# Altium project ESD-MONITOR.PrjPcb
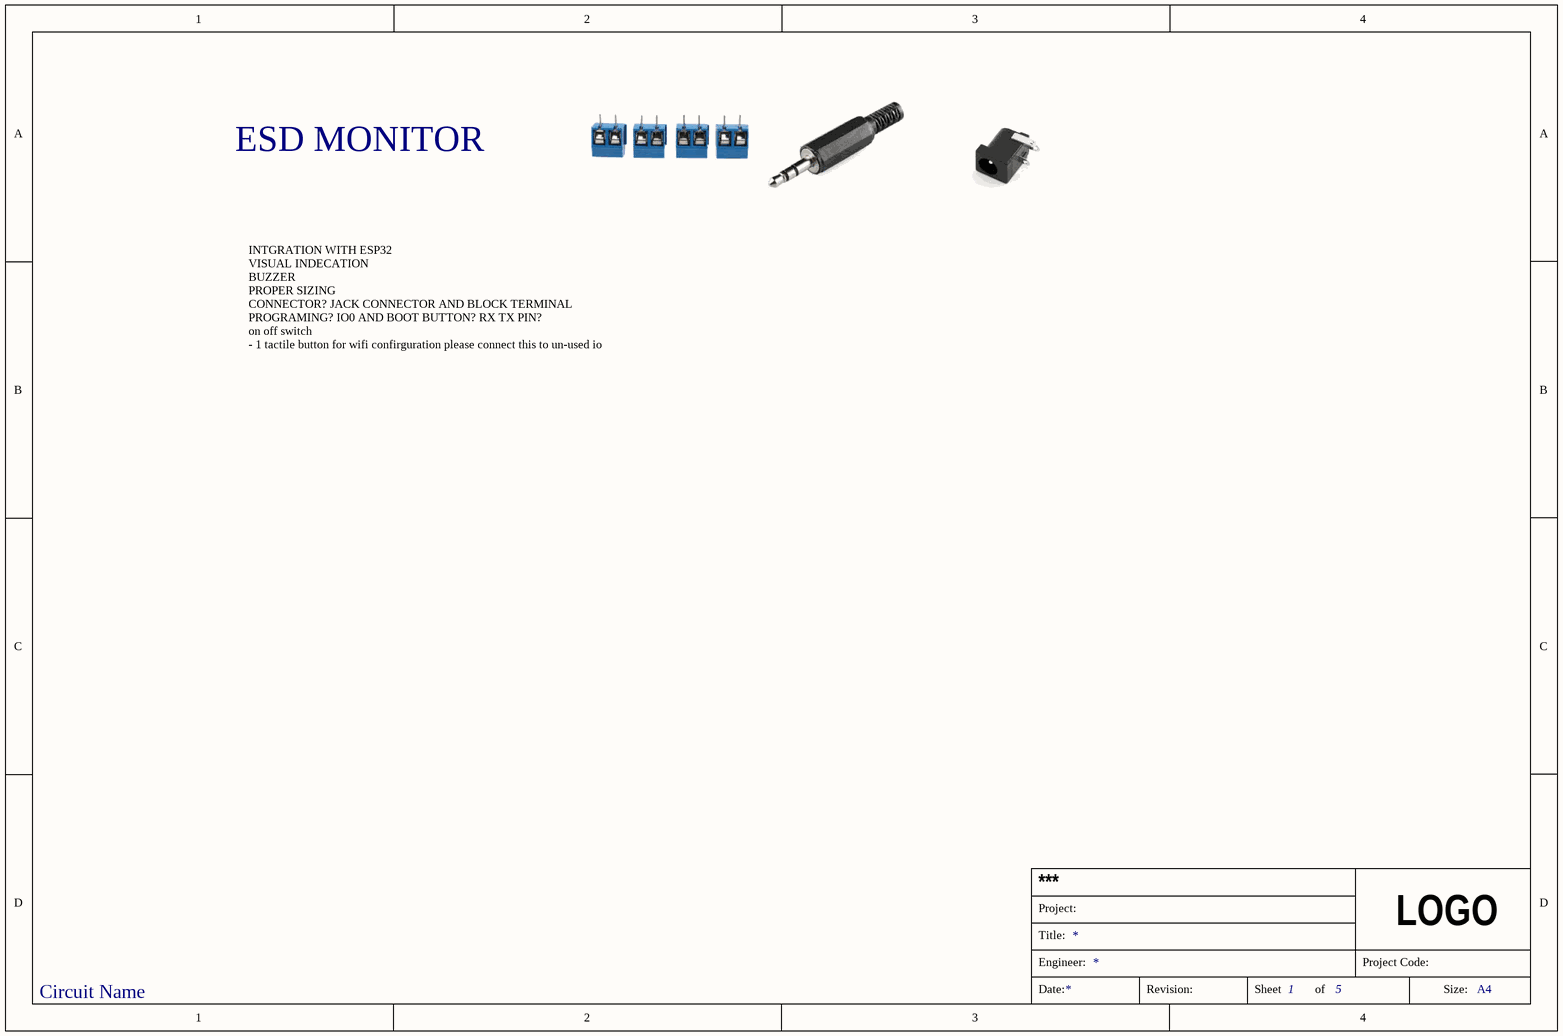
[diagram p0: ESD-INTERFACE.SchDoc]
6 sheets, 65 parts. Net scope: flat (ports and power ports of the same name join across sheets).
Board file: ESD-MAIN_PCB.PcbDoc
Sheets:
  ESD-INTERFACE.SchDoc
  ESD-HISTORY.SchDoc
  ESD-ESP32.SchDoc
  Sheet2.SchDoc
  ESD-MATT.SchDoc
  ESD-OP.SchDoc

## Sheet ESD-INTERFACE.SchDoc
size A4; DocumentNumber: 2; SheetNumber: 1; SheetTotal: 5

### Notes on the sheet
- ESD MONITOR
- INTGRATION WITH ESP32
  VISUAL INDECATION
  BUZZER
  PROPER SIZING
  CONNECTOR? JACK CONNECTOR AND BLOCK TERMINAL
  PROGRAMING? IO0 AND BOOT BUTTON? RX TX PIN?
  on off switch
  - 1 tactile button for wifi confirguration please connect this to un-used io
- Circuit Name
- Project:
- ***
- Title:
- Engineer:
- Project Code:
- LOGO
- Date:
- Revision:
- Sheet
- of
- Size:
- A4

## Sheet ESD-HISTORY.SchDoc
size A4; DocumentNumber: 1; SheetNumber: 2; SheetTotal: 6
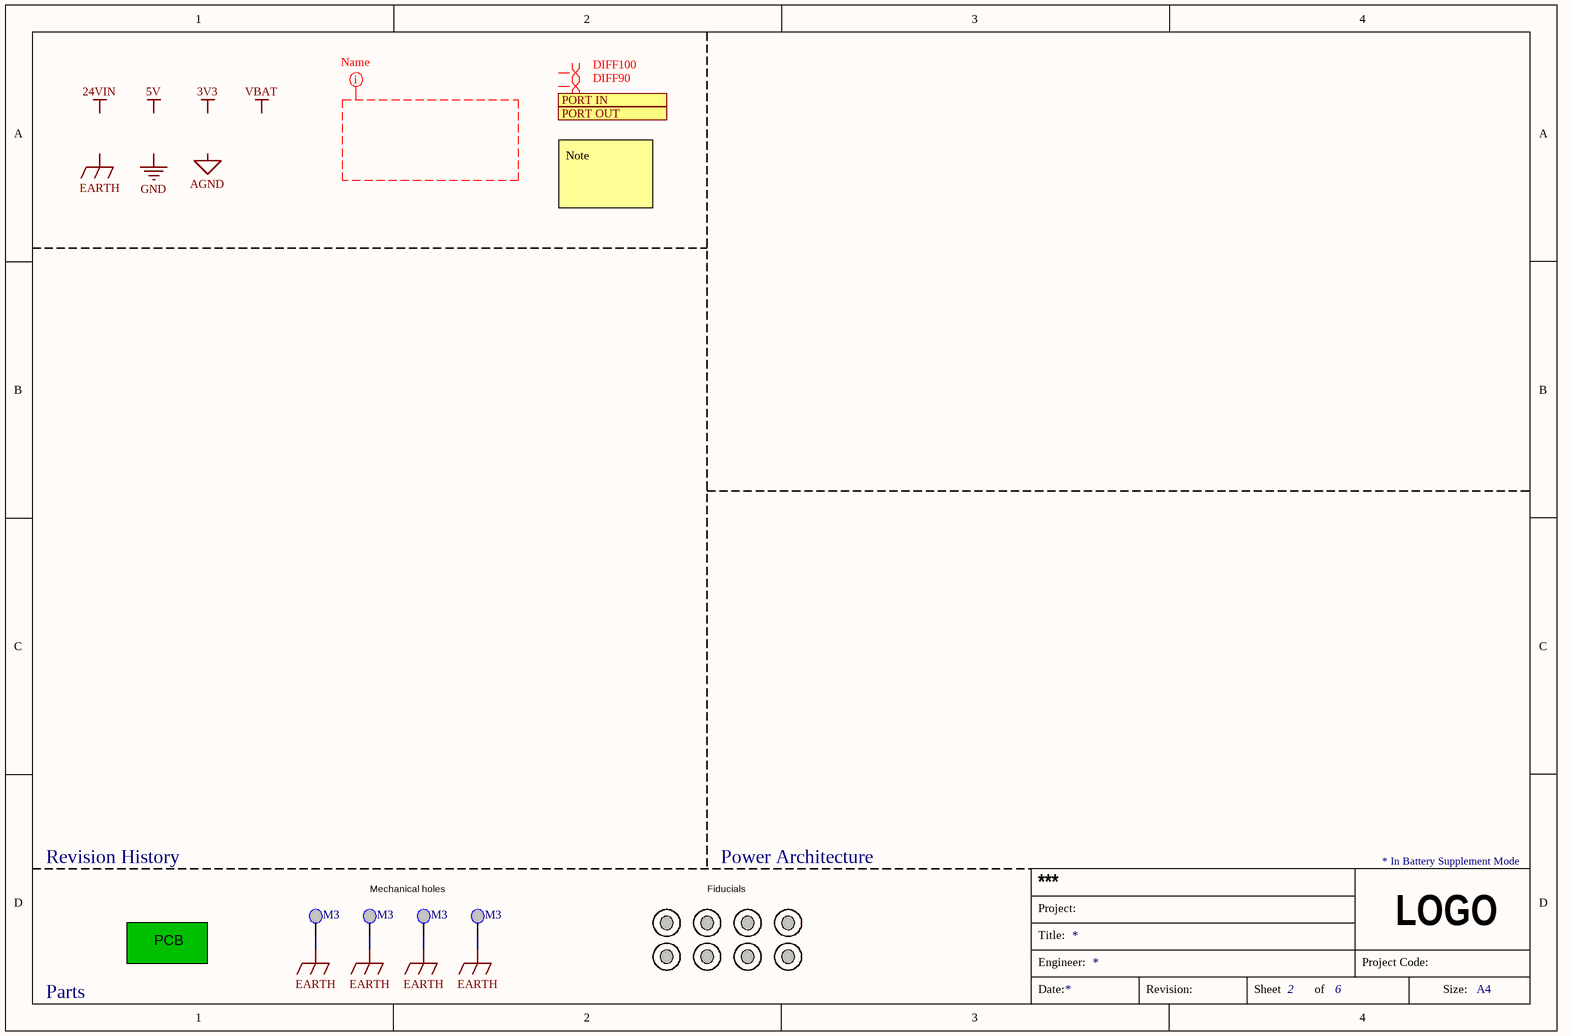
[diagram p1: ESD-HISTORY.SchDoc]

### Parts
_PCB1  PCB spec  (value not drawn)  (mechanical)
FD1  Fiducial 1.3  [Fiducial 1.3mm]  (value not drawn)  (no BOM)
FD2  Fiducial 1.3  [Fiducial 1.3mm]  (value not drawn)  (no BOM)
FD3  Fiducial 1.3  [Fiducial 1.3mm]  (value not drawn)  (no BOM)
FD4  Fiducial 1.3  [Fiducial 1.3mm]  (value not drawn)  (no BOM)
FD5  Fiducial 1.3  [Fiducial 1.3mm]  (value not drawn)  (no BOM)
FD6  Fiducial 1.3  [Fiducial 1.3mm]  (value not drawn)  (no BOM)
FD7  Fiducial 1.3  [Fiducial 1.3mm]  (value not drawn)  (no BOM)
FD8  Fiducial 1.3  [Fiducial 1.3mm]  (value not drawn)  (no BOM)
MEC1  M3  [M3 hole]  (no BOM)
MEC2  M3  [M3 hole]  (no BOM)
MEC3  M3  [M3 hole]  (no BOM)
MEC4  M3  [M3 hole]  (no BOM)

### Ports
PORT IN (in), PORT OUT (out)

### Nets
EARTH: MEC1.0 MEC2.0 MEC3.0 MEC4.0

### Layout directives
net class NetClass: (no net found under the mark)
differential pair; net class DIFF100: (no net found under the mark)
differential pair; net class DIFF90: (no net found under the mark)

### Notes on the sheet
- Note
- Revision History
- Mechanical holes
- Fiducials
- Power Architecture
- * In Battery Supplement Mode
- Parts
- Labels drawn without touching a wire or pin: 3V3, 5V, 24VIN, AGND, EARTH, GND, VBAT
- Project:
- ***
- Title:
- Engineer:
- Project Code:
- LOGO
- Date:
- Revision:
- Sheet
- of
- Size:
- A4

### Library data of the parts
_PCB1 = PCB
FD1-FD8 = Fiducial 1.3: Fiducial 1.3mm
MEC1-MEC4 = M3 hole

## Sheet ESD-ESP32.SchDoc
size A; SheetNumber: 3; SheetTotal: 6
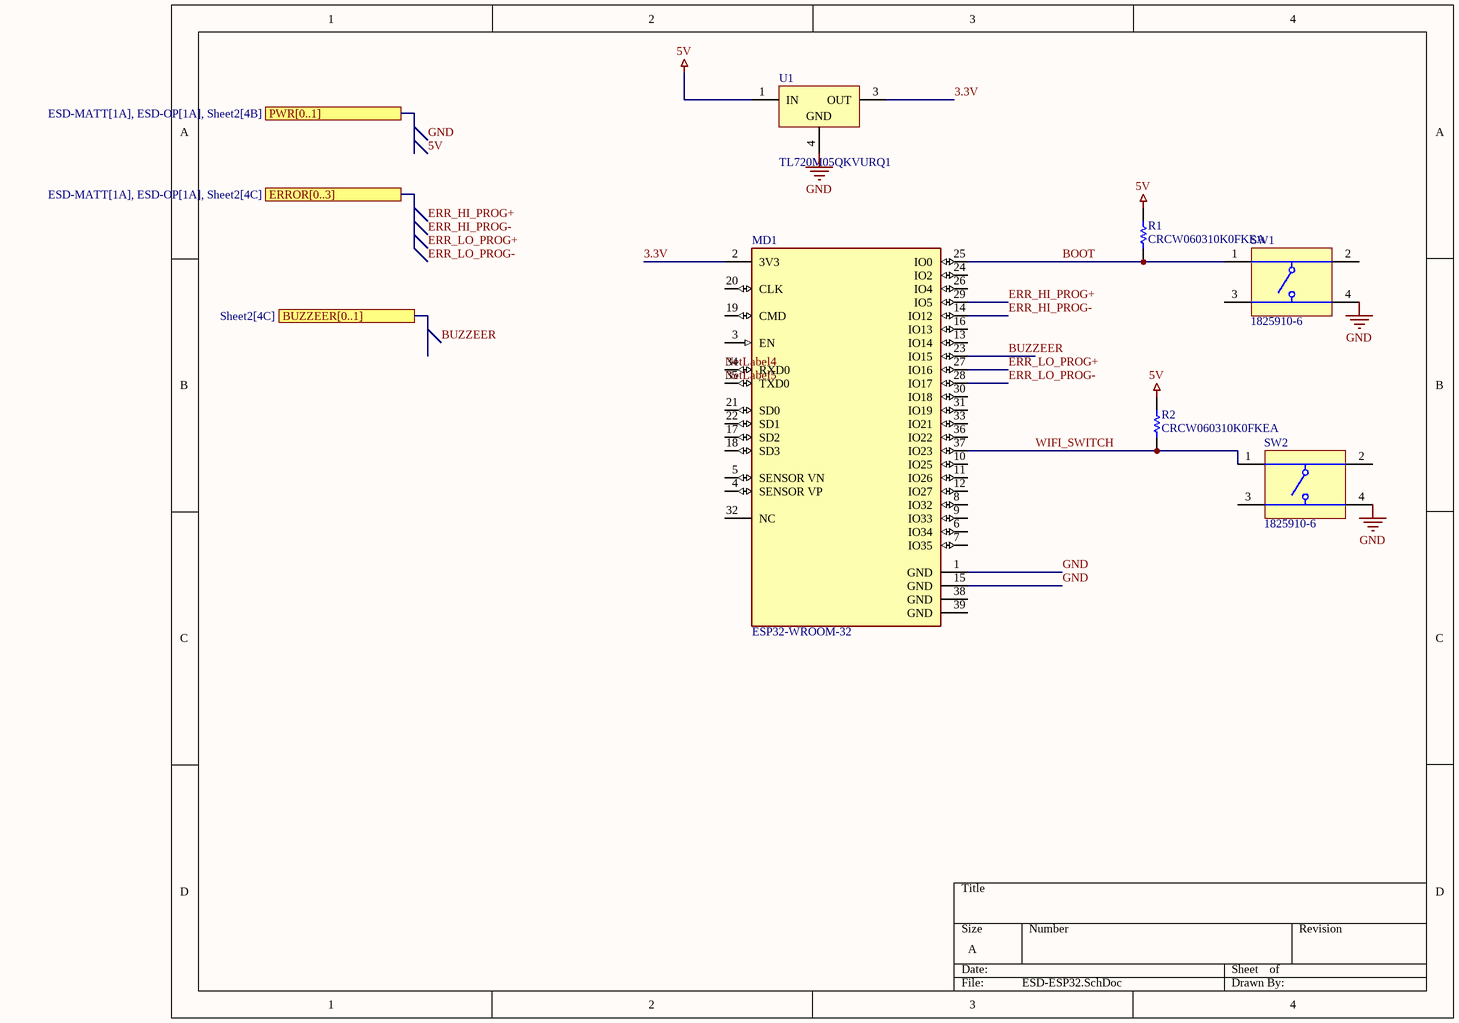
[diagram p2: ESD-ESP32.SchDoc]

### Parts
MD1  ESP32-WROOM-32  [FP-ESP32-WROOM-32-MFG]
R1  CRCW060310K0FKEA  [RESC1609X50X30NL8T20]
R2  CRCW060310K0FKEA  [RESC1609X50X30NL8T20]
SW1  1825910-6  [TECO-1825910-6_V]
SW2  1825910-6  [TECO-1825910-6_V]
U1  TL720M05QKVURQ1  [KVU0003A_M]

### Ports
BUZZEER[0..1] (see Sheet2[4C]), ERROR[0..3] (see ESD-MATT[1A], ESD-OP[1A], Sheet2[4C]), PWR[0..1] (see ESD-MATT[1A], ESD-OP[1A], Sheet2[4B])

### Nets
5V: R1.2 R2.2 U1.1(IN)  [project net ERR_HI_PROG+]
GND: MD1.1(GND) MD1.15(GND) SW1.4 SW2.4 U1.4(GND)  [project net ERR_LO_PROG-]
3.3V: MD1.2(3V3) U1.3(OUT)
BOOT: MD1.25(IO0) R1.1 SW1.1
BUZZEER: MD1.23(IO15)
ERR_HI_PROG+: MD1.29(IO5)
ERR_HI_PROG-: MD1.14(IO12)
ERR_LO_PROG+: MD1.27(IO16)
ERR_LO_PROG-: MD1.28(IO17)
NetLabel4: MD1.34(RXD0)
NetLabel5: MD1.35(TXD0)
WIFI_SWITCH: MD1.37(IO23) R2.1 SW2.1

Not connected (* = marked no-connect by the designer): MD1 3(EN) 4(SENSOR_VP) 5(SENSOR_VN) 6(IO34) 7(IO35) 8(IO32) 9(IO33) 10(IO25) 11(IO26) 12(IO27) 13(IO14) 16(IO13) 17(SD2) 18(SD3) 19(CMD) 20(CLK) 21(SD0) 22(SD1) 24(IO2) 26(IO4) 30(IO18) 31(IO19) 32(NC) 33(IO21) 36(IO22) 38(GND) 39(GND); SW1 2 3; SW2 2 3

### Notes on the sheet
- Labels drawn without touching a wire or pin: 5V, BUZZEER, ERR_HI_PROG+, ERR_HI_PROG-, ERR_LO_PROG+, ERR_LO_PROG-, GND

### Library data of the parts
MD1 = CMP-194065-000008-1: RX TXRX MOD WIFI SURFACE MOUNT; Frequency: 2.5GHz; Sensitivity: -98dBm; Operating Supply Voltage: 3.6V; Data Rate: 150Mbps; Weight: 0.088185oz; Package Quantity: 550; Min Operating Temperature: -40°C; Mount: Surface Mount; Max Operating Temperature: 85°C; Packaging: Cut Tape; Case/Package: SMD/SMT
R1 R2 = CMP-1666-00005-4: Chip Resistor, 10 KOhm, +/- 1%, 100 mW, -55 to 155 degC, 0603 (1608 Metric), RoHS, Tape and Reel; Manufacturer: Vishay Semiconductor; Voltage Rating: 75 V; Max Operating Temperature: 155 degC; PackageDescription: 2-Pin Surface Mount Device, Body 1.575 x 0.85 mm; ComponentLink1Description: Manufacturer URL; RoHSCompliant: true; PackageReference: 0603; REACH SVHC: Unknown; Length: 1.55 mm; DatasheetVersion: 06/2012; Packaging: Tape and Reel; Min Operating Temperature: -55 degC; Mounting Technology: Surface Mount; ComponentLink2URL: https://datasheet.ciiva.com/11809/0900766b80d98afc-11809037.pdf; Height: 0.45 mm; ComponentLink2Description: Datasheet; Package Quantity: 5000; ComponentLink1URL: http://www.vishay.com/
SW1 SW2 = CMP-1684-00021-1: Tact Switch, SPST-NO, 0.05 A, -35 to 85 degC, 4-Pin THD, RoHS, Bulk; Manufacturer: TE Connectivity; Maximum Contact Resistance: 100mOhm; Mechanical Life: 100000Cycles; Bushing Type: Unthreaded; Switch Configuration: OFF(ON); Maximum DC Voltage Rating: 24V; Contact Rating @ Voltage: 0.05A@24VDC; Actuator Color: Black; Body Orientation: Straight; Function: MomentaryContact; Illumination: N/R; Actuator Style: RoundButton; Actuator Material: PolybutyleneTerephthalate; Dielectric Strength: 500VAC; Pole Throw Configuration: SPST; Actuator Length: 1.4mm; Product Weight: N/A; Contact Material: CopperAlloy; Housing Material: N/A; Terminal Type: PCPins; Minimum Insulation Resistance: 100MOhm; Package Description: 4-Pin Through Hole Device, Body 5.99 x 5.99 mm, Pitch 6.5 mm; Part No: 1825910-6; Package Reference: THD; Base Material: N/A; Manufacturer URL: http://www.te.com; Contact Plating: Silver; RoHS: Yes; Datasheet Version: Rev. C9; Electrical Life: 100000Cycles; Maximum AC Voltage Rating: N/A; Thread Size: N/R; Operating Temperature: -35to85C; Mounting: ThroughHole; Dimension: 5.99x5mm; Datasheet URL: http://www.te.com/commerce/DocumentDelivery/DDEController?Action=showdoc&DocId=Customer+Drawing%7F1825910%7FC9%7Fpdf%7FEnglish%7FENG_CD_1825910_C9.pdf%7F1825910-6; Family: 1825910; Seal Location: N/A; Seal Description: N/A; Packaging: N/A
U1 = CMP-0395-01074-2: Single Output Automotive LDO, 700 mA, Fixed 5 V Output, 5.5 to 42 V Input, 3-pin PFM (KVU), -40 to 125 degC, Green (RoHS & no Sb/Br); Manufacturer: Texas Instruments; Vin(Max)(V): 42; Vout Adj(Min)(V): 5; Vin(Min)(V): 5.5; Iq(Typ)(mA): 12; SubFamily: Single Channel LDO; Accuracy(%): 3; Vdo(Typ)(mV): 250; Iout(Max)(A): 0.7; Mounting Technology: Surface Mount; ComponentLink1Description: Manufacturer URL; Code_JEDEC: TO-252; ComponentLink3URL: http://www.ti.com/litv/pdf/mpsf018c; Fixed Output Options(V): 5; ComponentLink2URL: http://www.ti.com/general/docs/lit/getliterature.tsp?genericPartNumber=TL720M05-Q1&fileType=pdf; ComponentLink2Description: Datasheet; ComponentLink3Description: Package Specification; PackageReference: KVU0003A; PackageVersion: 4205521-2/D; PartNumber: TL720M05QKVURQ1; PackageDescription: 3-Pin Plastic Flange Mount, Body 6.1 x 6.6 mm, Pitch 2.29 mm; DatasheetVersion: SGLS380D; Eco-Plan: Green (RoHS & no Sb/Br); ComponentLink1URL: http://www.ti.com/; Vout Adj(Max)(V): 5

## Sheet Sheet2.SchDoc
size A; SheetNumber: 4; SheetTotal: 6
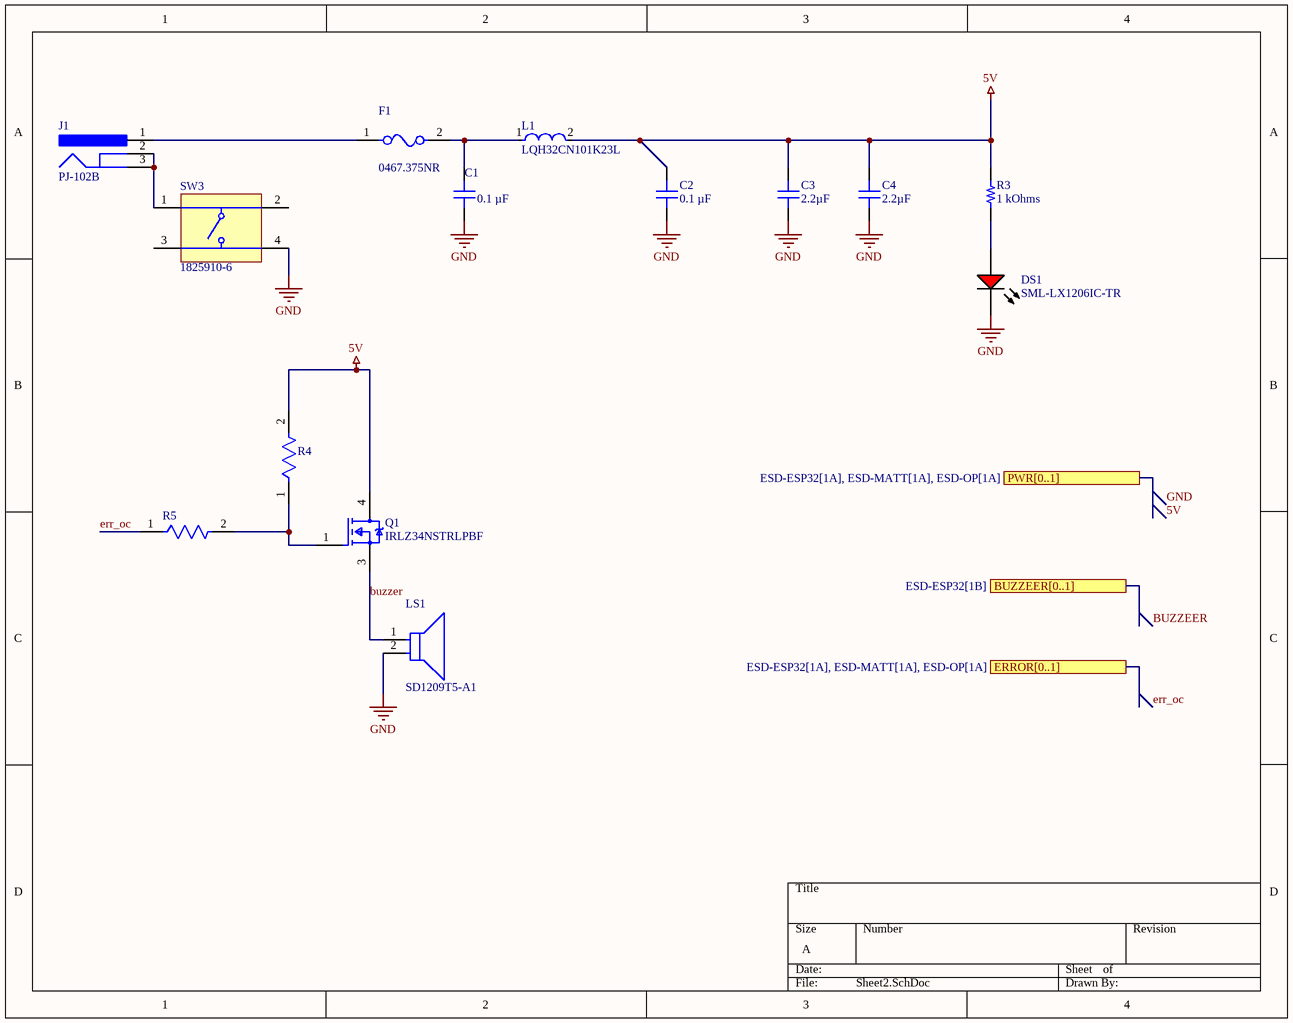
[diagram p3: Sheet2.SchDoc]

### Parts
C1  0.1 µF  [CAP 0603_1608]
C2  0.1 µF  [CAP 0603_1608]
C3  2.2µF  [CAP 0603_1608]
C4  2.2µF  [CAP 0603_1608]
DS1  SML-LX1206IC-TR  [LUMX-SML-LX1206IC_V]
F1  0467.375NR  [FP-467-MFG]
J1  PJ-102B  [CUI-PJ-102B_V]
L1  LQH32CN101K23L  [FP-LQH32CH_23-MFG]
LS1  SD1209T5-A1  [FP-SD1209-MFG]
Q1  IRLZ34NSTRLPBF  [FP-PG-TO263-3-MFG]
R3  1 kOhms  [KOA RES RK73 RN73 0402_1005]
R4  AC0603FR-072KL  [FP-AC0603-IPC_B]  (value not drawn)
R5  AC0603FR-072KL  [FP-AC0603-IPC_B]  (value not drawn)
SW3  1825910-6  [TECO-1825910-6_V]

### Ports
BUZZEER[0..1] (see ESD-ESP32[1B]), ERROR[0..1] (see ESD-ESP32[1A], ESD-MATT[1A], ESD-OP[1A]), PWR[0..1] (see ESD-ESP32[1A], ESD-MATT[1A], ESD-OP[1A])

### Nets
5V: C2.2 C3.2 C4.2 L1.2 Q1.4(D) R3.2 R4.2  [project net ERR_HI_PROG+]
GND: C1.1 C2.1 C3.1 C4.1 DS1.2(K) LS1.2(A) SW3.4  [project net ERR_LO_PROG-]
buzzer: LS1.1(C) Q1.3(S)
err_oc: R5.1
NetC1_2: C1.2 F1.2 L1.1
NetDS1_1: DS1.1(A) R3.1
NetF1_1: F1.1 J1.1
NetJ1_2: J1.2 J1.3 SW3.1
NetQ1_1: Q1.1(G) R4.1 R5.2

Not connected (* = marked no-connect by the designer): SW3 2 3

### Notes on the sheet
- Labels drawn without touching a wire or pin: 5V, BUZZEER, err_oc, GND

### Library data of the parts
C1 C2 = C0603X104J5RACAUTO: CAP CER 0.1UF 50V X7R 0603; manufacturer: KEMET; Tolerance: ±5%; Part Number: C0603X104J5RACAUTO; Value: 0.1 µF; Applications: Automotive, Boardflex Sensitive; Capacitance: 0.1 µF; componentlink1description: Datasheet; componentlink1url: https://api.kemet.com/component-edge/download/specsheet/C0603X104J5RACAUTO.pdf; componentlink2description: DigiKey Link; componentlink2url: https://www.digikey.com/en/products/detail/kemet/C0603X104J5RACAUTO/3314905; Device Package: 0603 (1608 Metric); Features: Soft Termination; lastupdated: 2/9/2024 8:10:26 PM; Lifecycle Status: Active; Minimum Order: 1; Mounting Type: Surface Mount, MLCC; Operating Temperature: -55°C ~ 125°C; Package / Case: 0603 (1608 Metric); packaging: TapeAndReel; partid: 40909; Part Status: Active; price: 0.12; Ratings: AEC-Q200; series: SMD Auto X7R Flex; Size / Dimension: 0.063" L x 0.031" W (1.60mm x 0.80mm); Supplier 1: DigiKey; Supplier Part Number 1: 399-6910-1-ND; Temperature Coefficient: X7R; Thickness (Max): 0.037" (0.95mm); Voltage - Rated: 50V
C3 C4 = 0603ZC225KAT2A: CAP CER 2.2UF 10V X7R 0603; manufacturer: AVX Corporation; Tolerance: ±10%; Part Number: 0603ZC225KAT2A; Value: 2.2µF; Applications: General Purpose; Capacitance: 2.2µF; componentlink1description: Datasheet; componentlink1url: http://datasheets.avx.com/X7RDielectric.pdf; componentlink2description: DigiKey Link; componentlink2url: http://digikey.com/product-detail/en/avx-corporation/0603ZC225KAT2A/478-11618-1-ND/8564176; Device Package: 0603 (1608 Metric); lastupdated: 9/2/2020 1:03:15 AM; Lifecycle Status: Active; Minimum Order: 1; Mounting Type: Surface Mount, MLCC; Operating Temperature: -55°C ~ 125°C; Package / Case: 0603 (1608 Metric); packaging: TapeAndReel; partid: 13741; Part Status: Active; price: 0.37; series: -; Size / Dimension: 0.063" L x 0.032" W (1.60mm x 0.81mm); Supplier 1: DigiKey; Supplier Part Number 1: 478-11618-1-ND; Temperature Coefficient: X7R; Thickness (Max): 0.037" (0.94mm); Voltage - Rated: 10V
DS1 = CMP-2000-07123-1: LED Red, 65 mW, -40 to 85 degC, 2-Pin SMD, RoHS, Tape and Reel; Manufacturer: Lumex; LED Material: GaAsP; Peak Wavelength: 635nm; Number of LEDs: 1; Viewing Angle: 160; Reverse Voltage: 5(Min)V; Lens Appearance: ColorlessNonDiffused; Intensity: 6mcd; Type: Uni-Color; Pin_Count: 2; Lens Dimensions: 2x1.6x0.5mm; Mounting: SurfaceMount; ECCN: EAR99; RoHS: Unknown; Package Description: 2-Pin Surface Mount Device, Body 3.2 x 1.5 mm; Mounting Technology: SurfaceMount; Dominant Wavelength: N/A; Supplier_Package: SMD; Supplier Standard Pack: 3,000; Color: Red; Dimension: 3.2x1.6x1.1mm; HTS: 8541402000; Part No: SML-LX1206IC-TR; Family: SML-LX1206IC; Supplier: Lumex; Datasheet URL: http://www.lumex.com/content/files/ProductAttachment/SML-LX1206IC-TR.pdf; Package Reference: SML-LX1206IC; Manufacturer URL: http://www.lumexinstruments.com/; Operating Temperature: -25to85C; Packaging: TapeandReel; Datasheet Version: Rev. J, 08/2012
F1 = CMP-08605-000028-1: FUSE BOARD MOUNT 375MA 32VAC/VDC; Manufacturer: Littelfuse; Fuse Current: 0.375A; Fuse Blow Speed: Fast; Max Fuse Dc Voltage: 32V; Fuse I2T: 0.0035A2Sec; Fuse Interrupt Dc Current: 50A; Octopart: https://octopart.com/0467.375nr-littelfuse-565971; Temperature: -55°C to +90°C; Mouser Description: Surface Mount Fuses 32V.375A VFA Slimline; Automotive: No; Category: Fuse; Temperature Range Low: -55°C; ComponentLink2Description: Datasheet; Max Fuse Ac Voltage: 32V; Lead Free: Yes; Package: 467; Manufacturer Part Number: 0467.375NR; Height: 0.432mm; RoHS: TRUE; ComponentLink2URL: https://www.littelfuse.com/~/media/electronics/datasheets/fuses/littelfuse_fuse_467_datasheet.pdf.pdf; Temperature Range High: +90°C; Device Class L1: Circuit Protection; Voltage Rating: 32V; Device Class L2: Fuses; Fuse Interrupt Ac Current: 50A; Digikey Description: FUSE BOARD MOUNT 375MA 32VAC/VDC; Device Class L3: unset
J1 = CMP-2000-06900-1: Through Hole Right Angle DC Power Jack, 2.5 A, 2.5 mm Center Pin, 3 Position, -25 to 85 degC, RoHS, Bulk; Manufacturer: CUIInc.; Insulation Resistance: 100MOhms; Inside Contact Diameter: 2.5mm; Outside Contact Diameter: 6.5mm; Voltage Rating: 24V; Current Rating: 2.5A; Brand: CUI; Datasheet URL: http://www.cui.com/product/resource/pj-102b.pdf; Housing Material: PolybutyleneTerephthalate(PBT); Operating Temperature Range: -25Cto+85C; Package Reference: PJ-102B; Factory Pack Quantity: 280; RoHS: True; Contact Material: Copper; Datasheet Version: Rev. 1.03, 04/2016; Product: Jacks; Mounting Angle: Right; Mounting Style: ThroughHole; Flammability Rating: UL94V-0; Product Category: DCPowerConnectors; Contact Gender: Male; Termination Style: ThroughHole; Manufacturer URL: http://www.cui.com/; Mounting Technology: ThroughHole; Package Description: 3-Pin Through Hole Device, Body 14.4 x 9 mm, Height 11 mm; Contact Plating: Nickel; Packaging: Bulk; Connector Type: DCPowerJack
L1 = CMP-06042-006648-2: Wire Wound Ferrite Inductor for Power Lines 100μH ±10% 4.55Ω 100mA 1210; Q Factor: 40; Current: 1.1A; Self Resonant Frequency: 10MHz; Shielding: Unshielded; DC Resistance (DCR): 3.5R; Test Frequency: 1MHz; Inductance: 100uH; Case Code (Imperial): 1210; Lead Free: Lead Free; Military Standard: Not; Mount: Surface Mount; REACH SVHC: No SVHC; Max Operating Temperature: 85°C; DC Current: 100mA; Weight: 0.002116oz; Radiation Hardening: No; Inductance Tolerance: 10%; Number of Pins: 2; Packaging: Tape and Reel; Rated Current-Max: 100mA; Termination: SMD/SMT; Max DC Current: 100mA; Current Rating: 100mA; Width: 2.5mm; Height: 2mm; Core Material: Ferrite; RoHS Compliant: Yes; Frequency: 10MHz; Package Quantity: 2000; Series: LQH32C_33; Case/Package: 1210; Length: 3.2mm; Tolerance: 10%; Min Operating Temperature: -40°C; Case Code (Metric): 3225; Depth: 2.7mm; Inductor Type: Wirewound
LS1 = CMP-08413-000009-1: AUDIO MAGNETIC XDCR 3-6V TH; Max Supply Current: 60mA; Number of Terminals/Pins: 2; Frequency: 2.048kHz; Washable: No; Operating Supply Voltage: 5V; Self Resonant Frequency: 2.05kHz; Min Operating Temperature: -40°C; Operating Supply Current: 60mA; Diameter: 12mm; Package Quantity: 100; Max Operating Temperature: 85°C; Sensing Method: Magnetic; Series: SD; Current Rating: 60mA; Lead Free: Lead Free; Height: 9mm; Packaging: Tray; Termination: PC Pins; Number of Pins: 2; Voltage Rating (DC): 5V; Mount: Through Hole
Q1 = CMP-32901-001250-1: MOSFET N-CH 55V 30A D2PAK; Turn-On Delay Time: 8.9ns; Drain to Source Resistance: 60mR; Rds On Max: 35mR; Power Dissipation: 68W; Max Power Dissipation: 3.8W; Gate to Source Voltage (Vgs): 16V; Input Capacitance: 880pF; Element Configuration: Single; Turn-Off Delay Time: 21ns; Threshold Voltage: 2V; Case/Package: D2PAK; Halogen Free: Halogen Free; Number of Pins: 3; Mount: Surface Mount; Height: 0.19inch; Lead Free: Contains Lead; RoHS Compliant: Yes; Min Operating Temperature: -55°C; Width: 0.38inch; Max Operating Temperature: 175°C; Packaging: Cut Tape; Reach SVHC Compliant: Yes; Length: 0.42inch; Drain to Source Voltage (Vdss): 55V; Continuous Drain Current (ID): 30A; Series: HEXFET®; Max Dual Supply Voltage: 55V
R3 = RK73H1ETTPB1001F: RES 1K OHM 1% 1/10W 0402; Manufacturer: KOA Speer Electronics, Inc.; Power (Watts): 0.1W, 1/10W; Temperature Coefficient: ±100ppm/°C; Part Number: RK73H1ETTPB1001F; Value: 1 kOhms; ComponentLink1Description: Datasheet; ComponentLink1URL: https://www.koaspeer.com/pdfs/RK73H.pdf; ComponentLink2Description: DigiKey Link; ComponentLink2URL: https://www.digikey.com/en/products/detail/koa-speer-electronics-inc/RK73H1ETTPB1001F/21680129; Composition: Thick Film; Device Package: 0402 (1005 Metric); Features: Automotive AEC-Q200; Height - Seated (Max): 0.016" (0.40mm); LastUpdated: 7/25/2024 9:41:20 AM; Lifecycle Status: Active; Minimum Order: 1; Number of Terminations: 2; Operating Temperature: -55°C ~ 155°C; Package / Case: 0402 (1005 Metric); Packaging: CutTape; PartId: 89462; Price: 0.01; Ratings: AEC-Q200; Resistance: 1 kOhms; Series: RK73H; Size / Dimension: 0.039" L x 0.020" W (1.00mm x 0.50mm); Supplier 1: DigiKey; Supplier Part Number 1: 2019-RK73H1ETTPB1001FCT-ND; Supplier Device Package: 0402; Tolerance: ±1%
R4 R5 = CMP-2000-04836-2: RES 2kΩ 1.00% 0.1W 0603; Resistance: 2kR; Voltage Rating: 50V; Max Power Dissipation: 100mW; Temperature Coefficient: 100ppm/°C; Tolerance: 1%; Height: 0.45mm; Case Code (Imperial): 0603; Number of Terminations: 2; Termination: SMD/SMT; Max Operating Temperature: 155°C; Min Operating Temperature: -55°C; Features: Moisture Resistant; Size Code: 0603; Military Standard: Not; Depth: 0.8mm; Lead Free: Lead Free; Ratings: AEC-Q200; Case Code (Metric): 1608; Power Rating: 100mW; Resistor Type: Thick Film; Length: 1.6mm; Case/Package: 0603; Packaging: Tape and Reel; Width: 0.8mm; Construction: Rectangular; Series: AC
SW3 = CMP-1684-00021-1: as SW1 on sheet ESD-ESP32; Product Weight: N/A; Contact Material: CopperAlloy; Housing Material: N/A; Terminal Type: PCPins; Minimum Insulation Resistance: 100MOhm; Package Description: 4-Pin Through Hole Device, Body 5.99 x 5.99 mm, Pitch 6.5 mm; Part No: 1825910-6; Package Reference: THD; Base Material: N/A; Manufacturer URL: http://www.te.com; Contact Plating: Silver; RoHS: Yes; Datasheet Version: Rev. C9; Electrical Life: 100000Cycles; Maximum AC Voltage Rating: N/A; Thread Size: N/R; Operating Temperature: -35to85C; Mounting: ThroughHole; Dimension: 5.99x5mm; Datasheet URL: http://www.te.com/commerce/DocumentDelivery/DDEController?Action=showdoc&DocId=Customer+Drawing%7F1825910%7FC9%7Fpdf%7FEnglish%7FENG_CD_1825910_C9.pdf%7F1825910-6; Family: 1825910; Seal Location: N/A; Seal Description: N/A; Packaging: N/A

## Sheet ESD-MATT.SchDoc
size A; SheetNumber: 5; SheetTotal: 6
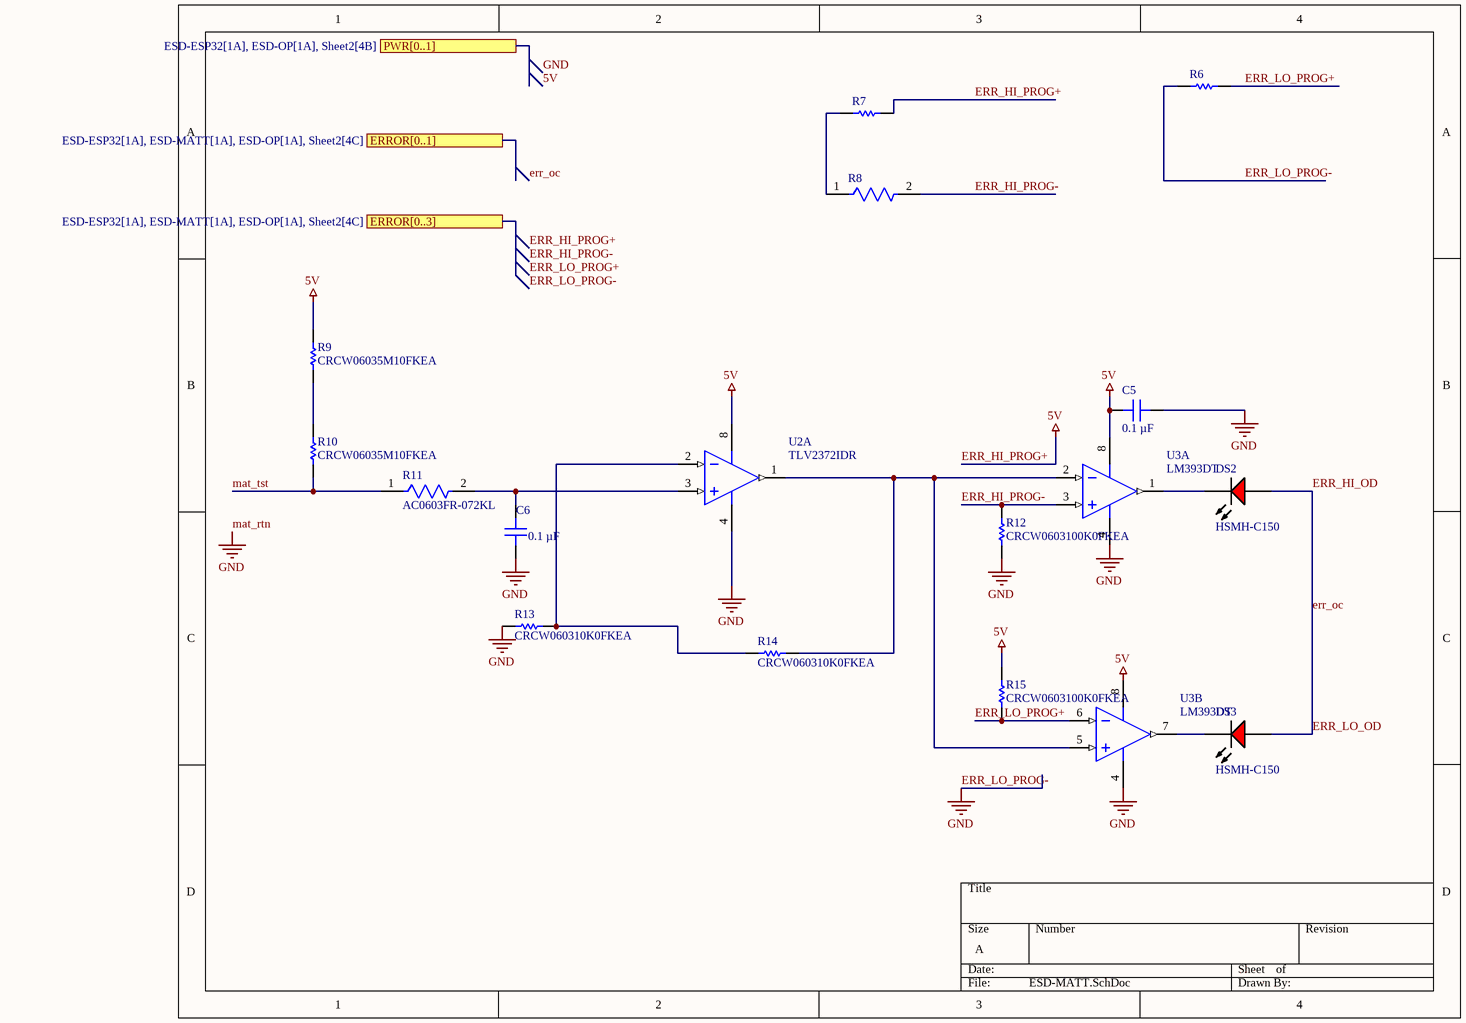
[diagram p4: ESD-MATT.SchDoc]

### Parts
C5  0.1 µF  [CAP 0603_1608]
C6  0.1 µF  [CAP 0603_1608]
DS2  HSMH-C150  [AVAG-HSMX-C150_V]
DS3  HSMH-C150  [AVAG-HSMX-C150_V]
R6  CRCW060310K0FKEA  [RESC1609X50X30NL8T20]  (value not drawn)
R7  CRCW060310K0FKEA  [RESC1609X50X30NL8T20]  (value not drawn)
R8  AC0603FR-072KL  [FP-AC0603-IPC_B]  (value not drawn)
R9  CRCW06035M10FKEA  [RESC1609X50X30NL10T20]
R10  CRCW06035M10FKEA  [RESC1609X50X30NL10T20]
R11  AC0603FR-072KL  [FP-AC0603-IPC_B]
R12  CRCW0603100K0FKEA  [RESC1609X50X30NL8T20]
R13  CRCW060310K0FKEA  [RESC1609X50X30NL8T20]
R14  CRCW060310K0FKEA  [RESC1609X50X30NL8T20]
R15  CRCW0603100K0FKEA  [RESC1609X50X30NL8T20]
U2  TLV2372IDR  [D0008A_M]  (part A of 2)
U3  LM393DT  [STM-SO-8_D_L]  (parts A,B of 2)

### Ports
ERROR[0..1] (see ESD-ESP32[1A], ESD-MATT[1A], ESD-OP[1A], Sheet2[4C]), ERROR[0..3] (see ESD-ESP32[1A], ESD-MATT[1A], ESD-OP[1A], Sheet2[4C]), PWR[0..1] (see ESD-ESP32[1A], ESD-OP[1A], Sheet2[4B])

### Nets
ERR_HI_PROG+: C5.2 R7.2 R9.2 R15.1 U2.8(VDD) U3.8(VCC+)  [also labelled 5V]
ERR_LO_PROG-: C5.1 C6.1 R6.1 R12.2 R13.1 U2.4(GND) U3.4(VCC-)  [also labelled GND, mat_rtn]
ERR_HI_OD: DS2.1(A) DS3.1(A)  [also labelled ERR_LO_OD, err_oc]
ERR_HI_PROG-: R8.2 R12.1 U3.3(IN1+)
ERR_LO_PROG+: R6.2 R15.2 U3.6(IN2-)
mat_tst: R10.1 R11.1
NetC6_2: C6.2 R11.2 U2.3(IN1+)
NetDS2_2: DS2.2(K) U3.1(OUT1)
NetDS3_2: DS3.2(K) U3.7(OUT2)
NetR7_1: R7.1 R8.1
NetR9_1: R9.1 R10.2
NetR13_2: R13.2 R14.1 U2.2(IN1-)
NetR14_2: R14.2 U2.1(OUT1) U3.2(IN1-) U3.5(IN2+)

### Notes on the sheet
- Labels drawn without touching a wire or pin: 5V, ERR_HI_PROG+, ERR_HI_PROG-, ERR_LO_PROG+, ERR_LO_PROG-, err_oc, GND

### Library data of the parts
C5 C6 = C0603X104J5RACAUTO: as C1 on sheet Sheet2; Part Number: C0603X104J5RACAUTO; Value: 0.1 µF; Applications: Automotive, Boardflex Sensitive; Capacitance: 0.1 µF; componentlink1description: Datasheet; componentlink1url: https://api.kemet.com/component-edge/download/specsheet/C0603X104J5RACAUTO.pdf; componentlink2description: DigiKey Link; componentlink2url: https://www.digikey.com/en/products/detail/kemet/C0603X104J5RACAUTO/3314905; Device Package: 0603 (1608 Metric); Features: Soft Termination; lastupdated: 2/9/2024 8:10:26 PM; Lifecycle Status: Active; Minimum Order: 1; Mounting Type: Surface Mount, MLCC; Operating Temperature: -55°C ~ 125°C; Package / Case: 0603 (1608 Metric); packaging: TapeAndReel; partid: 40909; Part Status: Active; price: 0.12; Ratings: AEC-Q200; series: SMD Auto X7R Flex; Size / Dimension: 0.063" L x 0.031" W (1.60mm x 0.80mm); Supplier 1: DigiKey; Supplier Part Number 1: 399-6910-1-ND; Temperature Coefficient: X7R; Thickness (Max): 0.037" (0.95mm); Voltage - Rated: 50V
DS2 DS3 = CMP-2000-06426-1: LED Uni-Color Red, 65 mW, 25 mA, -40 to 85 degC, 2-Pin SMD, RoHS, Tape and Reel; Manufacturer: Avago; Product Height (mm): 1.1mm; Power Dissipation: 78W; Product Length (mm): 3.2mm; Forward Voltage: 2.6V; Luminous Intensity: 17mcd; DELETED: Compliant; Shape Type: Rectangular; Peak Wavelength: 660nm; Main Category: ChipLED; Dominant Wave Length: 639nm; Rad Hardened: No; Lens Type: ColorlessDiffused; Product Depth (mm): 1.6mm; Reverse Voltage: 5V; Forward Current: 25mA; Chip Material: GaAlAs; Test Current (It): 20mA; Viewing Angle: 170deg; Number of  Elements: 1; Type: Uni-Color; Package Reference: HSMX-C150; Package Description: 2-Pin Surface Mount Device, Body 3.2 x 1.6 mm; Operating Temp Range: -40Cto85C; Mounting: SurfaceMount; Emitting Color: Red; Pin Count: 2; Operating Temperature Classification: Industrial; Datasheet URL: http://media.digikey.com/pdf/Data%20Sheets/Avago%20PDFs/HSMz-Czzz.pdf; Package Type: ChipLed; Mounting Technology: SurfaceMount; High Brightness: No; Lens Dimensions: 2x1.6x0.6mm; Manufacturer URL: http://www.avagotech.com/; Lum Intensity: 17mcd; Datasheet Version: 03/2012; Packaging: TapeandReel
R6 R7 R13 R14 = CMP-1666-00005-4: as R1 on sheet ESD-ESP32; Max Operating Temperature: 155 degC; PackageDescription: 2-Pin Surface Mount Device, Body 1.575 x 0.85 mm; ComponentLink1Description: Manufacturer URL; RoHSCompliant: true; PackageReference: 0603; REACH SVHC: Unknown; Length: 1.55 mm; DatasheetVersion: 06/2012; Packaging: Tape and Reel; Min Operating Temperature: -55 degC; Mounting Technology: Surface Mount; ComponentLink2URL: https://datasheet.ciiva.com/11809/0900766b80d98afc-11809037.pdf; Height: 0.45 mm; ComponentLink2Description: Datasheet; Package Quantity: 5000; ComponentLink1URL: http://www.vishay.com/
R8 R11 = CMP-2000-04836-2: as R4 on sheet Sheet2; Height: 0.45mm; Case Code (Imperial): 0603; Number of Terminations: 2; Termination: SMD/SMT; Max Operating Temperature: 155°C; Min Operating Temperature: -55°C; Features: Moisture Resistant; Size Code: 0603; Military Standard: Not; Depth: 0.8mm; Lead Free: Lead Free; Ratings: AEC-Q200; Case Code (Metric): 1608; Power Rating: 100mW; Resistor Type: Thick Film; Length: 1.6mm; Case/Package: 0603; Packaging: Tape and Reel; Width: 0.8mm; Construction: Rectangular; Series: AC
R9 R10 = CMP-2000-03491-1: Manufacturer: Vishay Dale; Part Number: CRCW06035M10FKEA
R12 R15 = CMP-1666-00005-4: Chip Resistor, 100 KOhm, +/- 1%, 100 mW, -55 to 155 degC, 0603 (1608 Metric), RoHS, Tape and Reel; Manufacturer: Vishay Semiconductor; Voltage Rating: 75 V; Max Operating Temperature: 155 degC; PackageDescription: 2-Pin Surface Mount Device, Body 1.575 x 0.85 mm; ComponentLink1Description: Manufacturer URL; RoHSCompliant: true; PackageReference: 0603; REACH SVHC: Unknown; Length: 1.55 mm; DatasheetVersion: 06/2012; Packaging: Tape and Reel; Min Operating Temperature: -55 degC; Mounting Technology: Surface Mount; ComponentLink2URL: https://datasheet.ciiva.com/11809/0900766b80d98afc-11809037.pdf; Height: 0.45 mm; ComponentLink2Description: Datasheet; Package Quantity: 5000; ComponentLink1URL: http://www.vishay.com/
U2 = CMP-0272-02948-3: 550 uA/Ch, 3 MHz, RRIO Operational Amplifier, 2.7 to 16 V, -40 to 125 degC, 8-pin SOIC (D8), Green (RoHS & no Sb/Br); Manufacturer: Texas Instruments; GBW(Typ)(MHz): 3; Offset Drift(Typ)(uV/C): 2; Total Supply Voltage(Max)(+5V is 5, +/-5V is 10): 16; Vio (25C)(Max)(mV): 4.5; Iq per channel(Max)(mA): 0.9; Packing: LARGE T&R; Sub Family: Low Supply Voltage Amplifier (<=2.7V), Precision Amplifier; IIB(Max)(pA): 60; Rating: Catalog; CMRR(Min)(dB): 50; Total Supply Voltage(Min)(+5V is 5, +/-5V is 10): 2.7; Slew Rate(Typ)(V/us): 2.4; ComponentLink1URL: http://www.ti.com/; ComponentLink2Description: Datasheet; PartNumber: TLV2372IDR; Code_JEDEC: MS-012; PackageDescription: 8-Pin Plastic Small Outline, Body 4.9 x 3.9 mm, Pitch 1.27 mm; ComponentLink1Description: Manufacturer URL; DatasheetVersion: SLOS270D; ComponentLink3Description: Package Specification; ComponentLink2URL: http://www.ti.com/lit/ds/symlink/tlv2372.pdf; ComponentLink3URL: http://www.ti.com/litv/pdf/msoi002j; Mounting Technology: Surface Mount; PackageVersion: 4040047-3/M, 06/2011; Eco-Plan: Green (RoHS & no Sb/Br); Number of Channels: 2; PackageReference: D0008A
U3 = CMP-2000-06550-1: Low-Power, Dual-Voltage Comparator, 2 to 36 V, 0 to 70 degC, 8-Pin SOIC (SO), RoHS, Tape and Reel; Manufacturer: STMicroelectronics; Voltage - Supply, Single/Dual (±): 2V~36V,±1V~18V; Current - Input Bias (Max): 0.25µA@5V; Number of Elements: 2; Current - Output (Typ): 18mA@5V; Other Names: 497-1593-2; Voltage - Input Offset (Max): 5mV@30V; Output Type: CMOS,DTL,ECL,MOS,Open-Collector,TTL; EDA / CAD Models: DownloadfromAcceleratedDesigns; Other Related Documents: LM393ViewAllSpecificationsLM393ViewAllSpecifications; Online Catalog: Comparators-2elements; Current - Quiescent (Max): 2.5mA; Standard Package: 2,500; Manufacturer URL: http://www.st.com/; Package Description: 8-Pin Small Outline Integrated Circuit, Body 4.9 x 3.9 mm, Pitch 1.27 mm; Packaging: Tape&Reel(TR); Datasheet Version: Rev. 15, 02/2016; Category: IntegratedCircuits(ICs); Operating Temperature: 0°C~70°C; Mounting Type: SurfaceMount; Supplier Device Package: 8-SO; Datasheet URL: http://www.st.com/content/ccc/resource/technical/document/datasheet/group1/b4/cc/cf/13/18/28/44/f5/CD00000465/files/CD00000465.pdf/jcr:content/translations/en.CD00000465.pdf; Family: Linear-Comparators; Mounting Technology: SurfaceMount; Type: GeneralPurpose; Package Reference: SO-8; Package / Case: 8-SOIC(0.154",3.90mmWidth)

## Sheet ESD-OP.SchDoc
size A; SheetNumber: 6; SheetTotal: 6
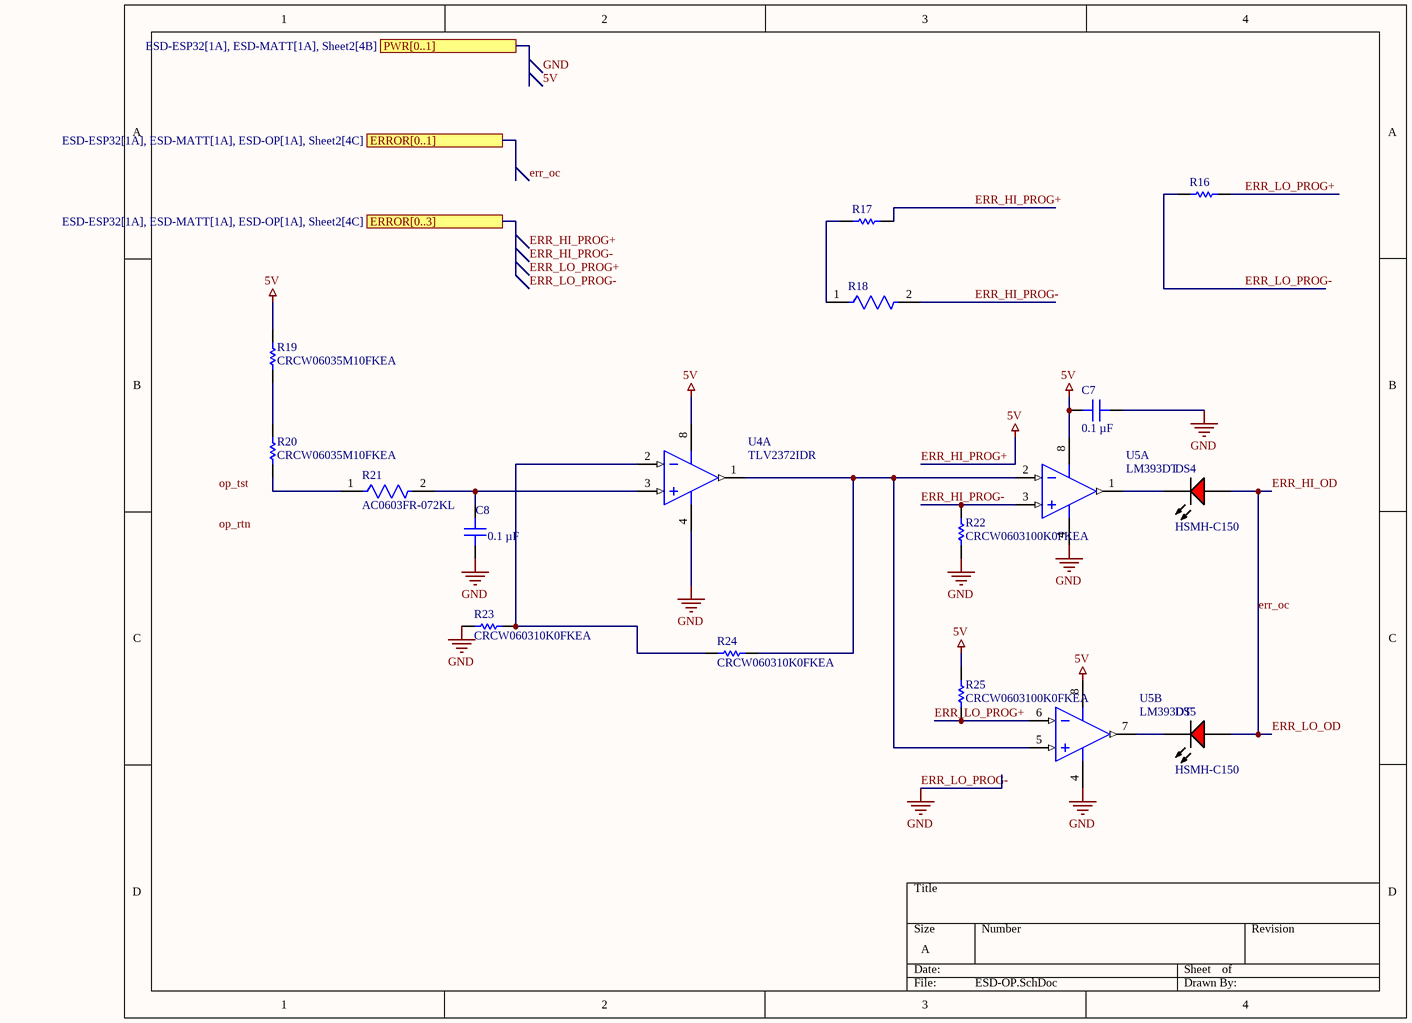
[diagram p5: ESD-OP.SchDoc]

### Parts
C7  0.1 µF  [CAP 0603_1608]
C8  0.1 µF  [CAP 0603_1608]
DS4  HSMH-C150  [AVAG-HSMX-C150_V]
DS5  HSMH-C150  [AVAG-HSMX-C150_V]
R16  CRCW060310K0FKEA  [RESC1609X50X30NL8T20]  (value not drawn)
R17  CRCW060310K0FKEA  [RESC1609X50X30NL8T20]  (value not drawn)
R18  AC0603FR-072KL  [FP-AC0603-IPC_B]  (value not drawn)
R19  CRCW06035M10FKEA  [RESC1609X50X30NL10T20]
R20  CRCW06035M10FKEA  [RESC1609X50X30NL10T20]
R21  AC0603FR-072KL  [FP-AC0603-IPC_B]
R22  CRCW0603100K0FKEA  [RESC1609X50X30NL8T20]
R23  CRCW060310K0FKEA  [RESC1609X50X30NL8T20]
R24  CRCW060310K0FKEA  [RESC1609X50X30NL8T20]
R25  CRCW0603100K0FKEA  [RESC1609X50X30NL8T20]
U4  TLV2372IDR  [D0008A_M]  (part A of 2)
U5  LM393DT  [STM-SO-8_D_L]  (parts A,B of 2)

### Ports
ERROR[0..1] (see ESD-ESP32[1A], ESD-MATT[1A], ESD-OP[1A], Sheet2[4C]), ERROR[0..3] (see ESD-ESP32[1A], ESD-MATT[1A], ESD-OP[1A], Sheet2[4C]), PWR[0..1] (see ESD-ESP32[1A], ESD-MATT[1A], Sheet2[4B])

### Nets
ERR_HI_PROG+: C7.2 R17.2 R19.2 R25.1 U4.8(VDD) U5.8(VCC+)  [also labelled 5V]
ERR_LO_PROG-: C7.1 C8.1 R16.1 R22.2 R23.1 U4.4(GND) U5.4(VCC-)  [also labelled GND]
ERR_HI_OD: DS4.1(A) DS5.1(A)  [also labelled ERR_LO_OD, err_oc]
ERR_HI_PROG-: R18.2 R22.1 U5.3(IN1+)
ERR_LO_PROG+: R16.2 R25.2 U5.6(IN2-)
NetC8_2: C8.2 R21.2 U4.3(IN1+)
NetDS4_2: DS4.2(K) U5.1(OUT1)
NetDS5_2: DS5.2(K) U5.7(OUT2)
NetR17_1: R17.1 R18.1
NetR19_1: R19.1 R20.2
NetR20_1: R20.1 R21.1
NetR23_2: R23.2 R24.1 U4.2(IN1-)
NetR24_2: R24.2 U4.1(OUT1) U5.2(IN1-) U5.5(IN2+)

### Notes on the sheet
- Labels drawn without touching a wire or pin: 5V, ERR_HI_PROG+, ERR_HI_PROG-, ERR_LO_PROG+, ERR_LO_PROG-, err_oc, GND, op_rtn, op_tst

### Library data of the parts
C7 C8 = C0603X104J5RACAUTO: as C1 on sheet Sheet2; Part Number: C0603X104J5RACAUTO; Value: 0.1 µF; Applications: Automotive, Boardflex Sensitive; Capacitance: 0.1 µF; componentlink1description: Datasheet; componentlink1url: https://api.kemet.com/component-edge/download/specsheet/C0603X104J5RACAUTO.pdf; componentlink2description: DigiKey Link; componentlink2url: https://www.digikey.com/en/products/detail/kemet/C0603X104J5RACAUTO/3314905; Device Package: 0603 (1608 Metric); Features: Soft Termination; lastupdated: 2/9/2024 8:10:26 PM; Lifecycle Status: Active; Minimum Order: 1; Mounting Type: Surface Mount, MLCC; Operating Temperature: -55°C ~ 125°C; Package / Case: 0603 (1608 Metric); packaging: TapeAndReel; partid: 40909; Part Status: Active; price: 0.12; Ratings: AEC-Q200; series: SMD Auto X7R Flex; Size / Dimension: 0.063" L x 0.031" W (1.60mm x 0.80mm); Supplier 1: DigiKey; Supplier Part Number 1: 399-6910-1-ND; Temperature Coefficient: X7R; Thickness (Max): 0.037" (0.95mm); Voltage - Rated: 50V
DS4 DS5 = CMP-2000-06426-1: as DS2 on sheet ESD-MATT; Type: Uni-Color; Package Reference: HSMX-C150; Package Description: 2-Pin Surface Mount Device, Body 3.2 x 1.6 mm; Operating Temp Range: -40Cto85C; Mounting: SurfaceMount; Emitting Color: Red; Pin Count: 2; Operating Temperature Classification: Industrial; Datasheet URL: http://media.digikey.com/pdf/Data%20Sheets/Avago%20PDFs/HSMz-Czzz.pdf; Package Type: ChipLed; Mounting Technology: SurfaceMount; High Brightness: No; Lens Dimensions: 2x1.6x0.6mm; Manufacturer URL: http://www.avagotech.com/; Lum Intensity: 17mcd; Datasheet Version: 03/2012; Packaging: TapeandReel
R16 R17 R23 R24 = CMP-1666-00005-4: as R1 on sheet ESD-ESP32; Max Operating Temperature: 155 degC; PackageDescription: 2-Pin Surface Mount Device, Body 1.575 x 0.85 mm; ComponentLink1Description: Manufacturer URL; RoHSCompliant: true; PackageReference: 0603; REACH SVHC: Unknown; Length: 1.55 mm; DatasheetVersion: 06/2012; Packaging: Tape and Reel; Min Operating Temperature: -55 degC; Mounting Technology: Surface Mount; ComponentLink2URL: https://datasheet.ciiva.com/11809/0900766b80d98afc-11809037.pdf; Height: 0.45 mm; ComponentLink2Description: Datasheet; Package Quantity: 5000; ComponentLink1URL: http://www.vishay.com/
R18 R21 = CMP-2000-04836-2: as R4 on sheet Sheet2; Height: 0.45mm; Case Code (Imperial): 0603; Number of Terminations: 2; Termination: SMD/SMT; Max Operating Temperature: 155°C; Min Operating Temperature: -55°C; Features: Moisture Resistant; Size Code: 0603; Military Standard: Not; Depth: 0.8mm; Lead Free: Lead Free; Ratings: AEC-Q200; Case Code (Metric): 1608; Power Rating: 100mW; Resistor Type: Thick Film; Length: 1.6mm; Case/Package: 0603; Packaging: Tape and Reel; Width: 0.8mm; Construction: Rectangular; Series: AC
R19 R20 = CMP-2000-03491-1: Manufacturer: Vishay Dale; Part Number: CRCW06035M10FKEA
R22 R25 = CMP-1666-00005-4: as R12 on sheet ESD-MATT; Max Operating Temperature: 155 degC; PackageDescription: 2-Pin Surface Mount Device, Body 1.575 x 0.85 mm; ComponentLink1Description: Manufacturer URL; RoHSCompliant: true; PackageReference: 0603; REACH SVHC: Unknown; Length: 1.55 mm; DatasheetVersion: 06/2012; Packaging: Tape and Reel; Min Operating Temperature: -55 degC; Mounting Technology: Surface Mount; ComponentLink2URL: https://datasheet.ciiva.com/11809/0900766b80d98afc-11809037.pdf; Height: 0.45 mm; ComponentLink2Description: Datasheet; Package Quantity: 5000; ComponentLink1URL: http://www.vishay.com/
U4 = CMP-0272-02948-3: as U2 on sheet ESD-MATT; ComponentLink1URL: http://www.ti.com/; ComponentLink2Description: Datasheet; PartNumber: TLV2372IDR; Code_JEDEC: MS-012; PackageDescription: 8-Pin Plastic Small Outline, Body 4.9 x 3.9 mm, Pitch 1.27 mm; ComponentLink1Description: Manufacturer URL; DatasheetVersion: SLOS270D; ComponentLink3Description: Package Specification; ComponentLink2URL: http://www.ti.com/lit/ds/symlink/tlv2372.pdf; ComponentLink3URL: http://www.ti.com/litv/pdf/msoi002j; Mounting Technology: Surface Mount; PackageVersion: 4040047-3/M, 06/2011; Eco-Plan: Green (RoHS & no Sb/Br); Number of Channels: 2; PackageReference: D0008A
U5 = CMP-2000-06550-1: as U3 on sheet ESD-MATT; Standard Package: 2,500; Manufacturer URL: http://www.st.com/; Package Description: 8-Pin Small Outline Integrated Circuit, Body 4.9 x 3.9 mm, Pitch 1.27 mm; Packaging: Tape&Reel(TR); Datasheet Version: Rev. 15, 02/2016; Category: IntegratedCircuits(ICs); Operating Temperature: 0°C~70°C; Mounting Type: SurfaceMount; Supplier Device Package: 8-SO; Datasheet URL: http://www.st.com/content/ccc/resource/technical/document/datasheet/group1/b4/cc/cf/13/18/28/44/f5/CD00000465/files/CD00000465.pdf/jcr:content/translations/en.CD00000465.pdf; Family: Linear-Comparators; Mounting Technology: SurfaceMount; Type: GeneralPurpose; Package Reference: SO-8; Package / Case: 8-SOIC(0.154",3.90mmWidth)

## Nets that join several sheets
ERR_HI_PROG+: ESD-ESP32 (R1.2 R2.2 U1.1), Sheet2 (7 pins), ESD-MATT (6 pins), ESD-OP (6 pins)
ERR_LO_PROG-: ESD-ESP32 (5 pins), Sheet2 (7 pins), ESD-MATT (7 pins), ESD-OP (7 pins)